# EAGLE schematic four (EAGLE 6.5.0)
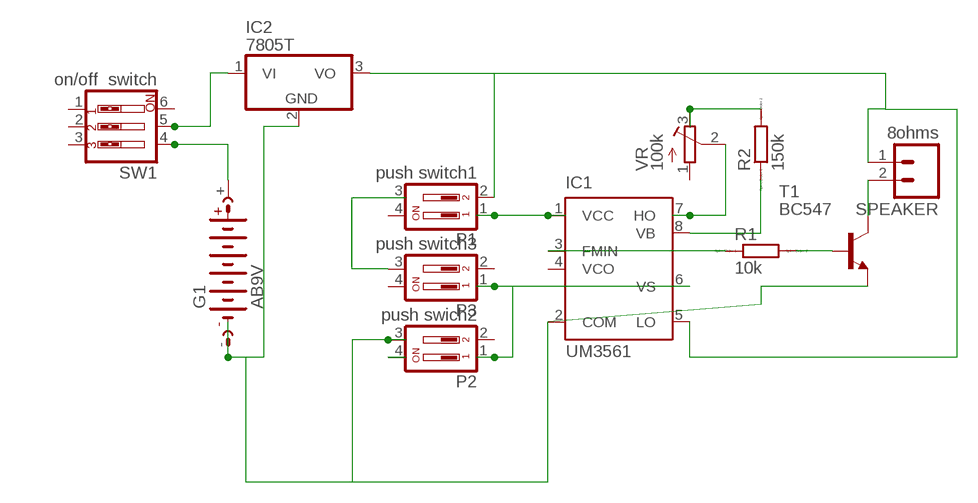
[diagram p0: schematic, sheet 1]

## Parts
G1  AB9V  [AB9V]
IC1  UM3561  IR2520D  [DIL08]
IC2  7805T  [TO220H]
P1  push switch1  DS02  [DS-02]
P2  push swich2  DS02  [DS-02]
P3  push switch3  DS02  [DS-02]
R1  10k  R0204/7  [0204/7]
R2  150k  R0204/7  [0204/7]
SPEAKER  8ohms  M02  [02P]
SW1  on/off switch  SW_DIP-3  [EDG-03]
T1  BC547  [TO92]
VR  100k  R-TRIMM64P  [RTRIM64P]

## Nets
N$1: IC1.3(FMIN) R1.1
N$2: R1.2 T1.2(B)
N$3: SPEAKER.2 T1.3(C)
N$4: IC1.8(VB) R2.1
N$5: R2.2 VR.3(A)
N$6: IC1.7(HO) VR.2(S)
N$7: IC2.1(VI) SW1.5
N$8: G1.- IC1.2(COM) IC2.2(GND) P2.3 T1.1(E)
N$9: IC1.6(VS) P2.1 P3.1
N$10: P2.4
N$11: IC1.5(LO) IC2.3(VO) P1.2 SPEAKER.1
N$12: IC1.1(VCC) P1.1
N$14: P1.3 P3.3
N$15: G1.+ SW1.4
Unconnected: IC1.4(VCO) P1.4 P2.2 P3.2 P3.4 SW1.1 SW1.2 SW1.3 SW1.6 VR.1(E)

## Library data of the parts
G1 = battery:AB9V: 9-V BATTERY CLIP
IC1 = ir:IR2520D: ADAPTIVE BALLAST CONTROL IC The IR2520D(S) is a complete adaptive ballast controller and 600V half-bridge driver integrated into a single IC for fluorescent lighting applications. Data Sheet No. PD60212 Rev A Source: www.irf.com .. ir2520.pdf; MF: INTERNATIONAL RECTIFIER(IR); MPN: IR2520DPBF; OC_FARNELL: 1080633; OC_NEWARK: 63J7916
IC2 = linear:78*: Positive VOLTAGE REGULATOR Source: http://cache.national.com/ds/LM/LM78L05.pdf http://www.fairchildsemi.com/ds/LM/LM7805.pdf
P1-P3 = switch-dil:DS02: DIL/CODE SWITCH; OC_FARNELL: 9472126; OC_NEWARK: unknown
R1 R2 = eagle-ltspice:R: RESISTOR, European symbol; SPICEMODEL: NONE; SPICEPREFIX: R
SPEAKER = con-amp-quick:M02: AMP QUICK CONNECTOR; OC_FARNELL: unknown; OC_NEWARK: unknown
SW1 = special:SW_DIP-3: DIP SWITCH
T1 = transistor:BC547: NPN TRANSISTOR
VR = resistor:R-TRIMM: Trimm resistor